# EasyEDA schematic emb.json
TITLE: Sheet_1; REV: 1.0; Date: 2025-01-20; Sheet: 1/1; Company: Your Company
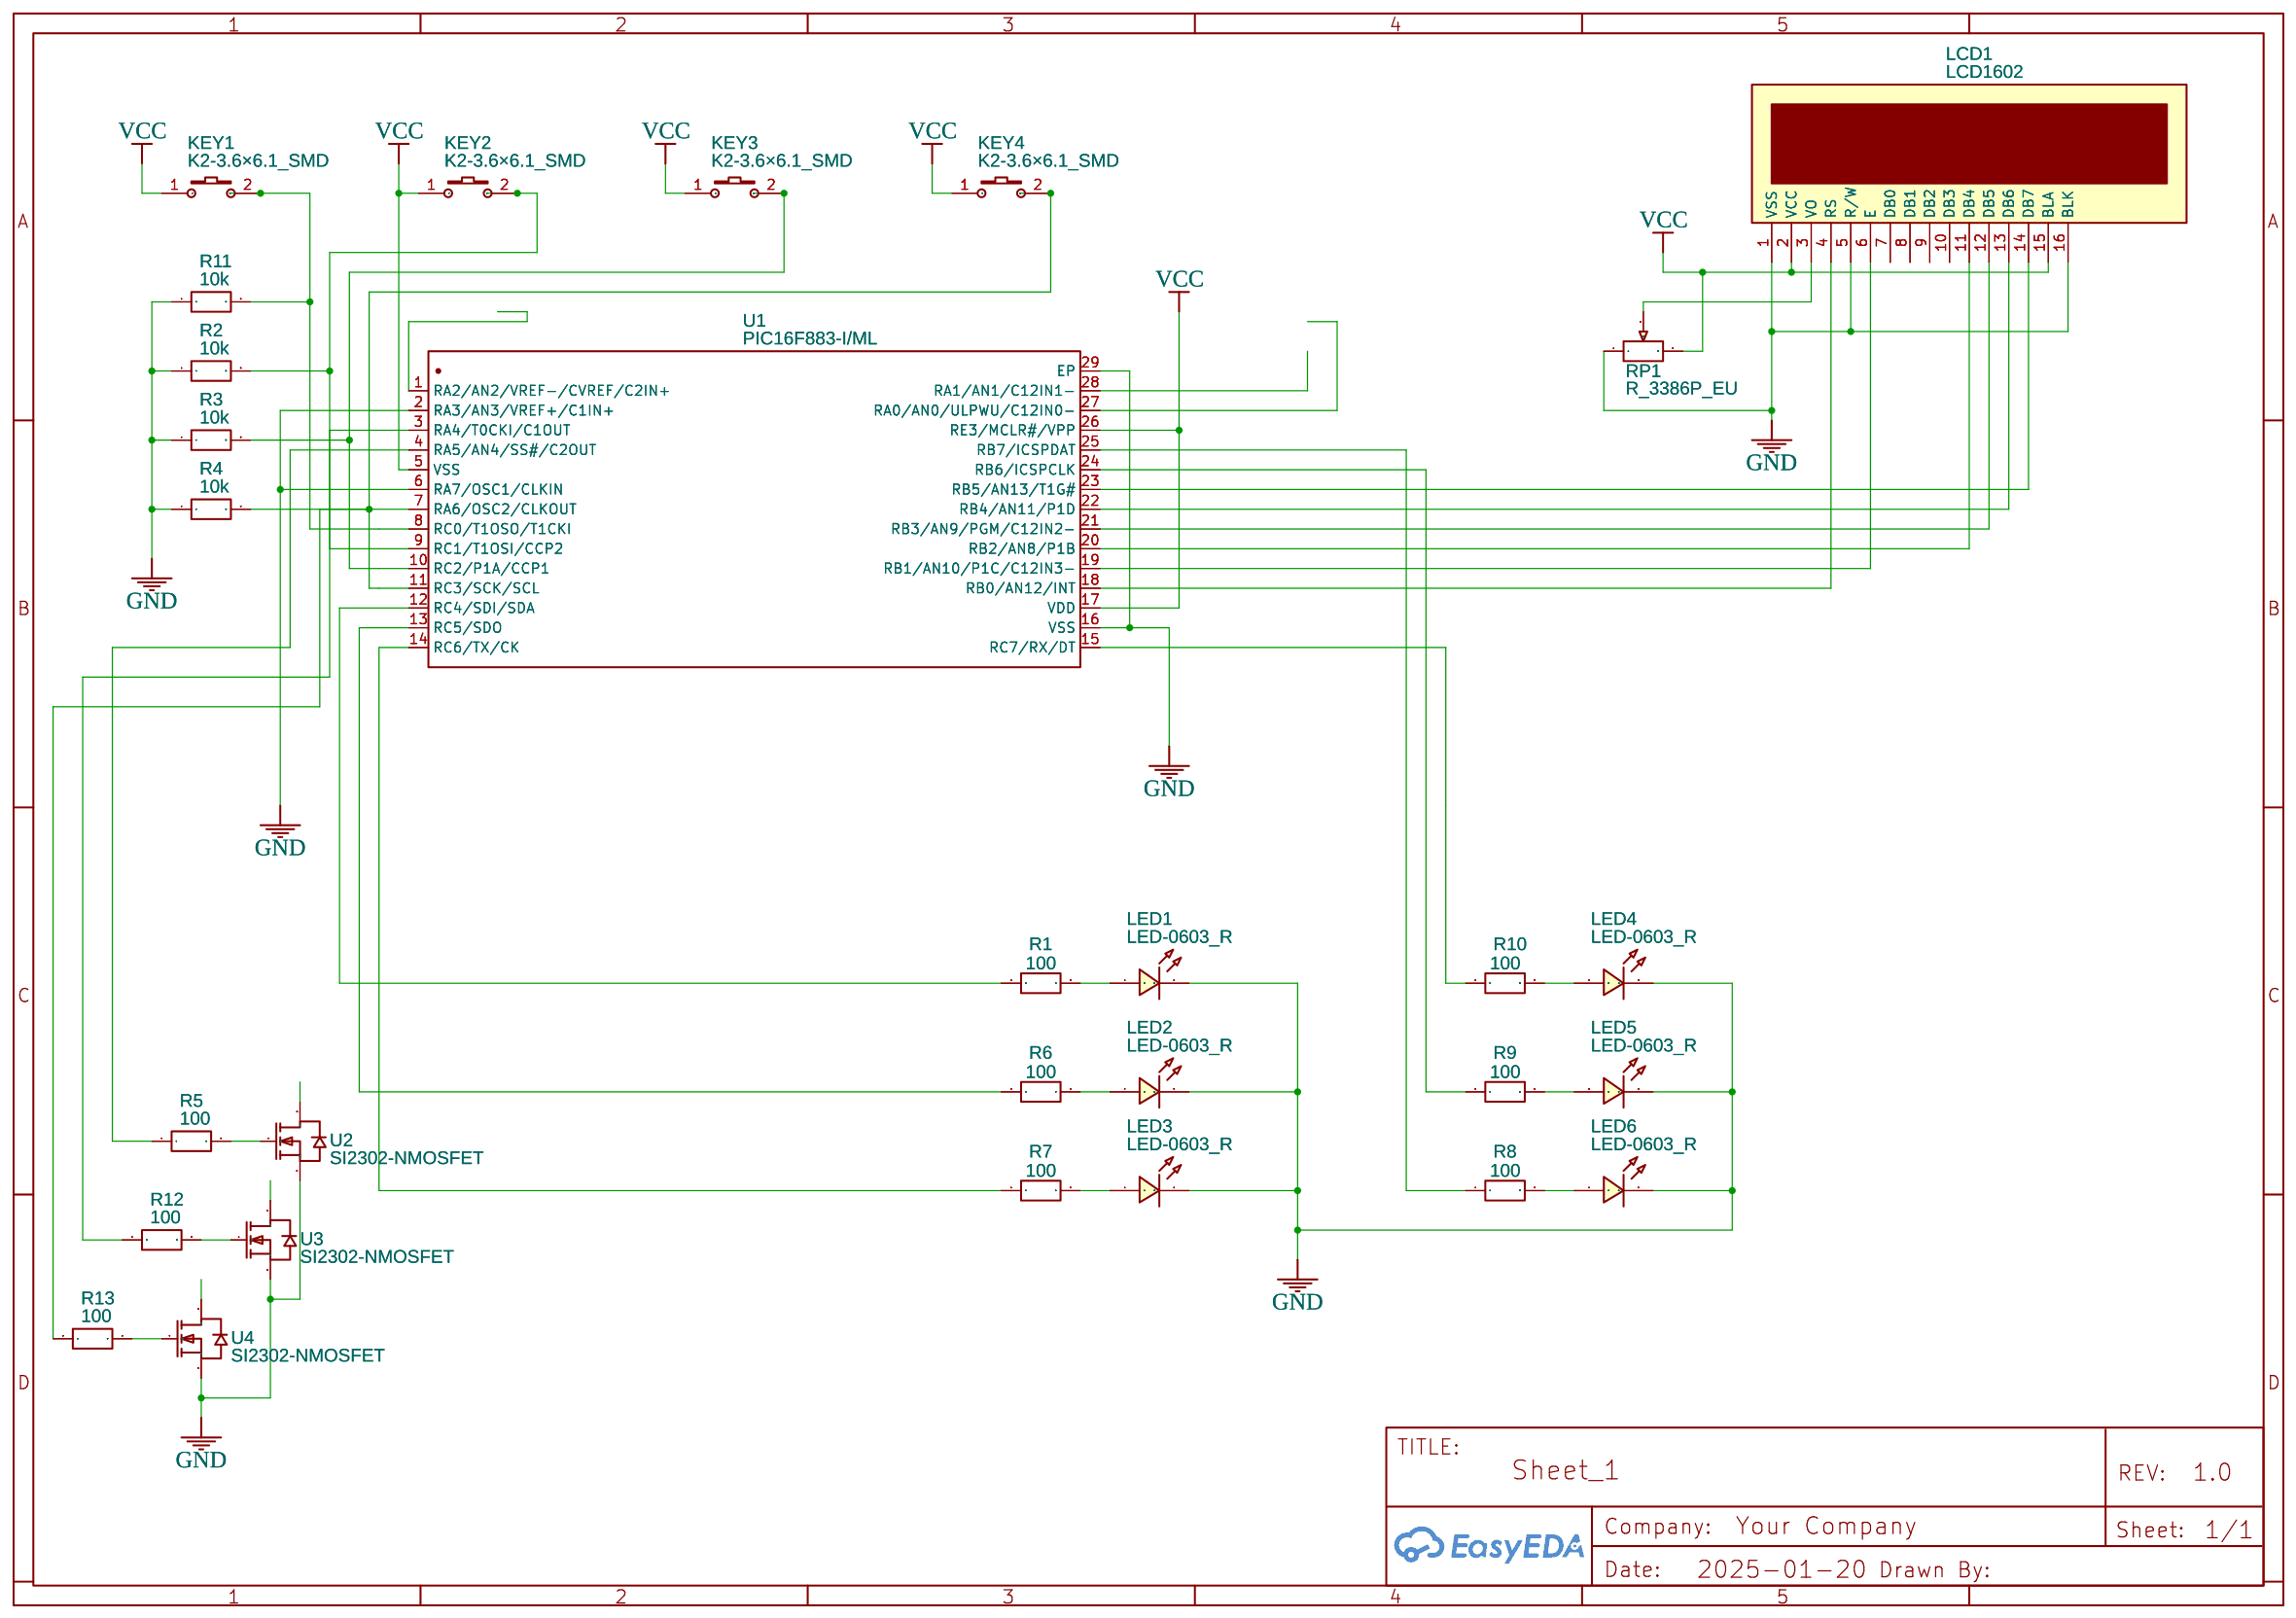
[diagram p0: schematic sheet]

## Parts
KEY1  K2-3.6×6.1_SMD  [KEY-SMD_2P-L6.2-W3.6-LS8.0]
KEY2  K2-3.6×6.1_SMD  [KEY-SMD_2P-L6.2-W3.6-LS8.0]
KEY3  K2-3.6×6.1_SMD  [KEY-SMD_2P-L6.2-W3.6-LS8.0]
KEY4  K2-3.6×6.1_SMD  [KEY-SMD_2P-L6.2-W3.6-LS8.0]
LCD1  LCD1602  [LCD1602]
LED1  LED-0603_R  [LED0603_RED]
LED2  LED-0603_R  [LED0603_RED]
LED3  LED-0603_R  [LED0603_RED]
LED4  LED-0603_R  [LED0603_RED]
LED5  LED-0603_R  [LED0603_RED]
LED6  LED-0603_R  [LED0603_RED]
R1  100  [R0603]
R2  10k  [R0603]
R3  10k  [R0603]
R4  10k  [R0603]
R5  100  [R0603]
R6  100  [R0603]
R7  100  [R0603]
R8  100  [R0603]
R9  100  [R0603]
R10  100  [R0603]
R11  10k  [R0603]
R12  100  [R0603]
R13  100  [R0603]
RP1  R_3386P_EU  [RES-ADJ-TH_3386P]
U1  PIC16F883-I/ML  [QFN-28_L6.0-W6.0-P0.65-BL-EP3.7]
U2  SI2302-NMOSFET  [SOT-23-3_L2.9-W1.3-P1.90-LS2.4-BR]
U3  SI2302-NMOSFET  [SOT-23-3_L2.9-W1.3-P1.90-LS2.4-BR]
U4  SI2302-NMOSFET  [SOT-23-3_L2.9-W1.3-P1.90-LS2.4-BR]

## Library data of the parts
KEY1-KEY4 = K2-3.6×6.1_SMD: Supplier Part: C118141; Supplier: LCSC; Manufacturer Part: K2-1107ST-A4SW-06; Contributor: LCEDA_Lib; 制造商: 韩国韩荣
LCD1 = LCD1602: Manufacturer: LONTECH(厦门龙特); Manufacturer Part: LCM1602K-NSW-BBW; Supplier Part: C83275; Supplier: LCSC; Contributor: LCEDA_Lib
LED1-LED6 = LED-0603_R: Manufacturer: EVERLIGHT(台湾亿光); Manufacturer Part: 19-217/R6C-AL1M2VY/3T; Supplier Part: C72044; Supplier: LCSC; Contributor: LCEDA_01
R1-R13 = R_0603_EU: Contributor: LCEDA_Lib
RP1 = R_3386P_EU: Supplier: LCSC; Contributor: LCEDA_Lib; Value(Ω): 10K
U1 = PIC16F883-I/ML: Contributor: lcsc; Supplier: LCSC; Supplier Part: C639857; Manufacturer: MICROCHIP(美国微芯); JLCPCB Part Class: Extended Part
U2-U4 = SI2302-NMOSFET: Contributor: LCSC; Supplier: LCSC; Supplier Part: C9900002167; Manufacturer: null; Manufacturer Part: si2302-nmosfet

## Nets
GND: LCD1.1(VSS) LCD1.5(R/W) LCD1.16(BLK) LED1.2 LED2.2 LED3.2 LED4.2 LED5.2 LED6.2 R2.1 R3.1 R4.1 R11.1 RP1.1 U1.2(RA3/AN3/VREF+/C1IN+) U1.6(RA7/OSC1/CLKIN) U1.16(VSS) U1.29(EP) U2.2(S) U3.2(S) U4.2(S)
VCC: KEY1.1 KEY2.1 KEY3.1 KEY4.1 LCD1.2(VCC) LCD1.15(BLA) RP1.3 U1.5(VSS) U1.17(VDD) U1.26(RE3/MCLR#/VPP)
Net-(KEY1-2): KEY1.2 R11.2 U1.8(RC0/T1OSO/T1CKI)
Net-(KEY2-2): KEY2.2 R2.2 U1.9(RC1/T1OSI/CCP2)
Net-(KEY3-2): KEY3.2 R3.2 U1.10(RC2/P1A/CCP1)
Net-(KEY4-2): KEY4.2 R4.2 R13.1 U1.7(RA6/OSC2/CLKOUT) U1.11(RC3/SCK/SCL)
Net-(LCD1-3): LCD1.3(VO) RP1.2
Net-(LCD1-4): LCD1.4(RS) U1.18(RB0/AN12/INT)
Net-(LCD1-6): LCD1.6(E) U1.19(RB1/AN10/P1C/C12IN3-)
Net-(LCD1-11): LCD1.11(DB4) U1.20(RB2/AN8/P1B)
Net-(LCD1-12): LCD1.12(DB5) U1.21(RB3/AN9/PGM/C12IN2-)
Net-(LCD1-13): LCD1.13(DB6) U1.22(RB4/AN11/P1D)
Net-(LCD1-14): LCD1.14(DB7) U1.23(RB5/AN13/T1G#)
Net-(LED1-1): LED1.1 R1.2
Net-(LED2-1): LED2.1 R6.2
Net-(LED3-1): LED3.1 R7.2
Net-(LED4-1): LED4.1 R10.2
Net-(LED5-1): LED5.1 R9.2
Net-(LED6-1): LED6.1 R8.2
Net-(R1-1): R1.1 U1.12(RC4/SDI/SDA)
Net-(R5-1): R5.1 U1.4(RA5/AN4/SS#/C2OUT)
Net-(R5-2): R5.2 U2.1(G)
Net-(R6-1): R6.1 U1.13(RC5/SDO)
Net-(R7-1): R7.1 U1.14(RC6/TX/CK)
Net-(R8-1): R8.1 U1.25(RB7/ICSPDAT)
Net-(R9-1): R9.1 U1.24(RB6/ICSPCLK)
Net-(R10-1): R10.1 U1.15(RC7/RX/DT)
Net-(R12-1): R12.1 U1.3(RA4/T0CKI/C1OUT)
Net-(R12-2): R12.2 U3.1(G)
Net-(R13-2): R13.2 U4.1(G)

Not connected (* = marked no-connect by the designer): LCD1 7(DB0) 8(DB1) 9(DB2) 10(DB3); U1 1(RA2/AN2/VREF-/CVREF/C2IN+) 27(RA0/AN0/ULPWU/C12IN0-) 28(RA1/AN1/C12IN1-); U2 3(D); U3 3(D); U4 3(D)
